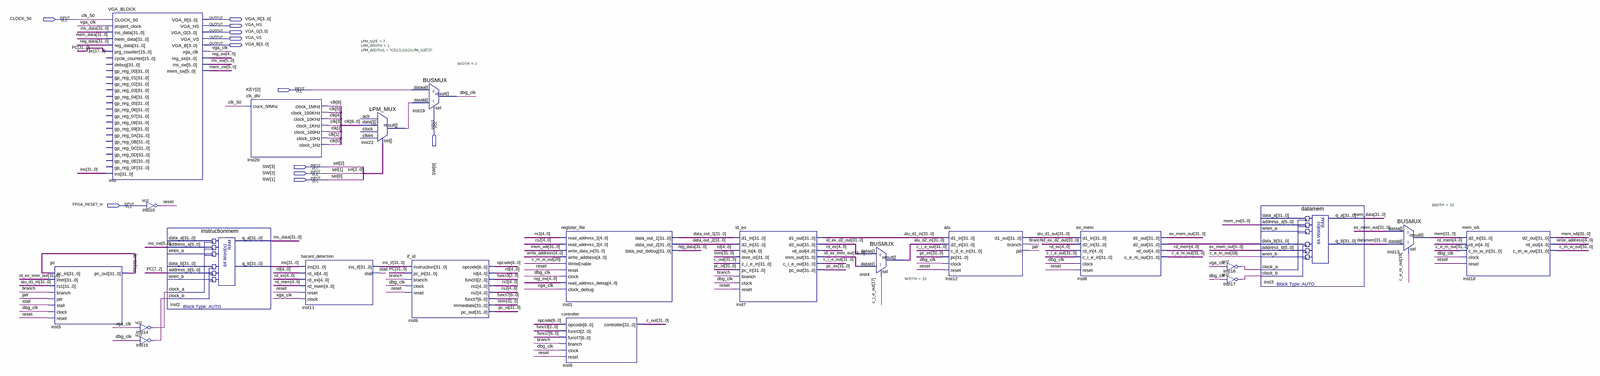
[diagram p0: schematic sheet, whole]
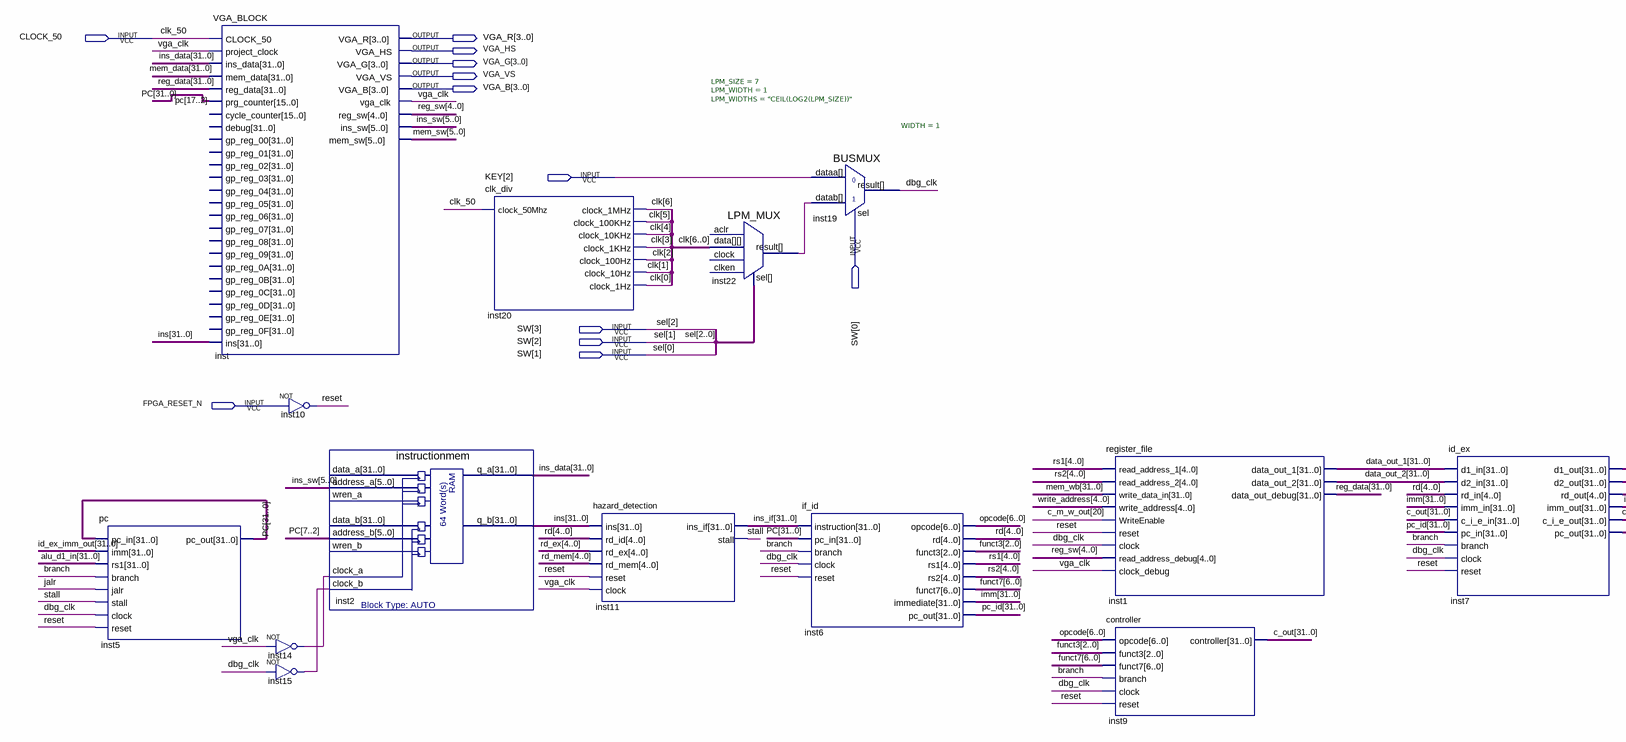
[diagram p1: schematic sheet, left part]
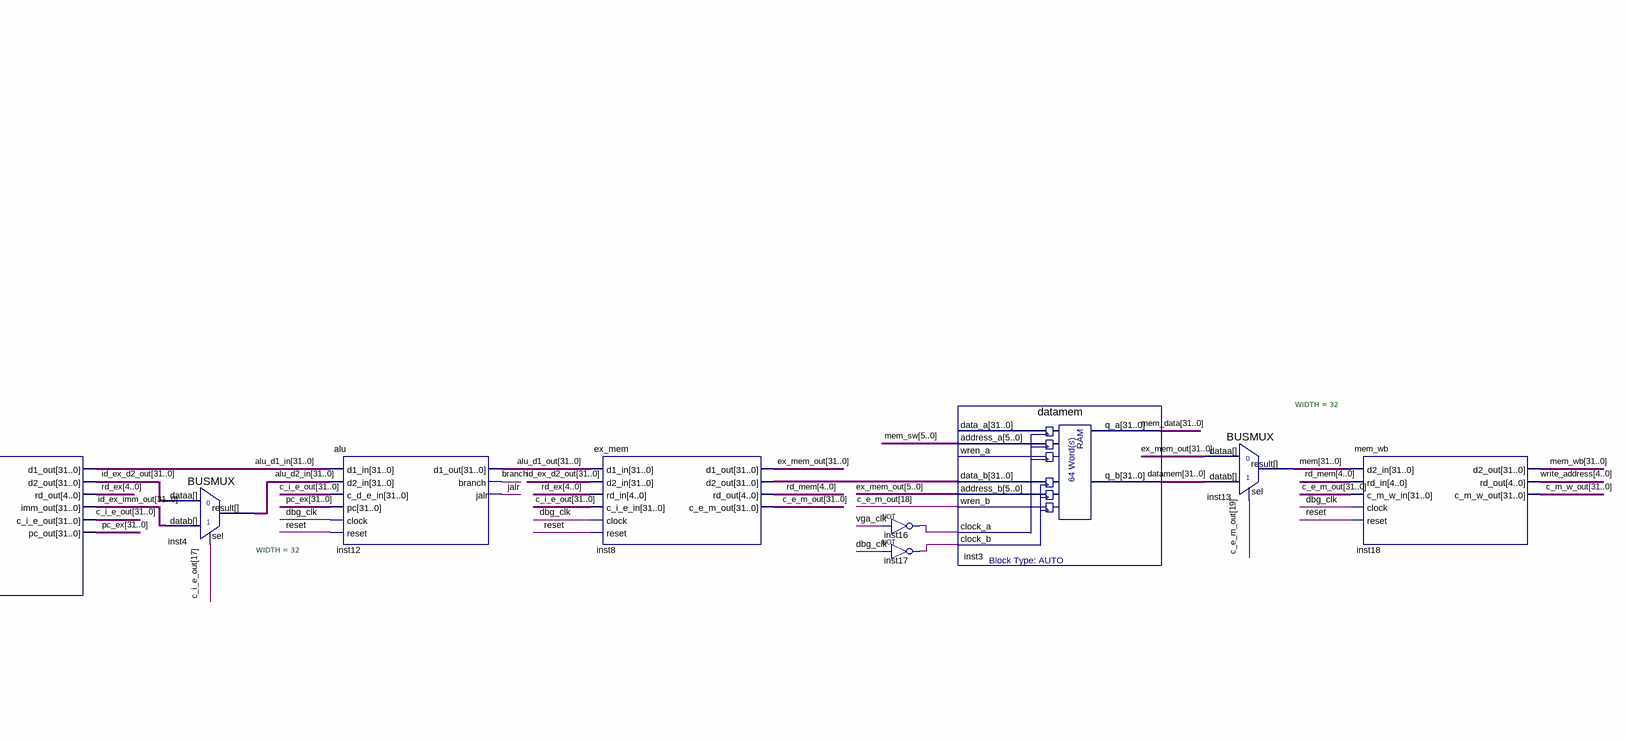
[diagram p2: schematic sheet, right part]
// Quartus schematic top.bdf as structural Verilog: 22 symbols, 12 pins
module top (
  input  CLOCK_50,
  input  [2:2] KEY,
  input  [3:0] SW,
  input  FPGA_RESET_N,
  output [3:0] VGA_R,
  output VGA_HS,
  output [3:0] VGA_G,
  output VGA_VS,
  output [3:0] VGA_B
);

  wire branch, dbg_clk, inst14_out, inst15_out, inst16_out, inst17_out, inst22_result, jalr, reset, stall,
       vga_clk;
  wire [2:0] funct3;
  wire [4:0] rd, rd_ex, rd_mem, reg_sw, rs1, rs2, write_address;
  wire [5:0] ins_sw, mem_sw;
  wire [6:0] clk, funct7, opcode;
  wire [31:0] alu_d1_in, alu_d1_out, alu_d2_in, c_e_m_out, c_i_e_out, c_m_w_out, c_out, data_out_1,
       data_out_2, datamem, ex_mem_out, id_ex_d2_out, id_ex_imm_out, imm, ins, ins_data, ins_if,
       inst8_d2_out, mem, mem_data, mem_wb, PC, pc_ex, pc_id, reg_data;

  pc inst5 (
    .pc_in(PC), .imm(id_ex_imm_out), .rs1(alu_d1_in), .branch(branch), .jalr(jalr), .stall(stall),
    .clock(dbg_clk), .reset(reset), .pc_out(PC));
  VGA_BLOCK inst (
    .CLOCK_50(CLOCK_50), .project_clock(vga_clk), .ins_data(ins_data), .mem_data(mem_data),
    .reg_data(reg_data), .prg_counter(PC[17:2]), .ins(ins), .VGA_R(VGA_R), .VGA_HS(VGA_HS), .VGA_G(VGA_G),
    .VGA_VS(VGA_VS), .VGA_B(VGA_B), .vga_clk(vga_clk), .reg_sw(reg_sw), .ins_sw(ins_sw), .mem_sw(mem_sw));  // open: cycle_counter, debug, gp_reg_00, gp_reg_01, gp_reg_02, gp_reg_03, gp_reg_04, gp_reg_05, gp_reg_06, gp_reg_07, gp_reg_08, gp_reg_09, gp_reg_0A, gp_reg_0B, gp_reg_0C, gp_reg_0D, gp_reg_0E, gp_reg_0F
  not inst10 (reset, FPGA_RESET_N);
  not inst14 (inst14_out, vga_clk);
  not inst15 (inst15_out, dbg_clk);
  instructionmem inst2 (
    .address_a(ins_sw), .address_b(PC[7:2]), .clock_a(inst14_out), .clock_b(inst15_out), .q_a(ins_data),
    .q_b(ins));  // open: data_a, wren_a, data_b, wren_b
  clk_div inst20 (
    .clock_50Mhz(CLOCK_50), .clock_1MHz(clk[6]), .clock_100KHz(clk[5]), .clock_10KHz(clk[4]),
    .clock_1KHz(clk[3]), .clock_100Hz(clk[2]), .clock_10Hz(clk[1]), .clock_1Hz(clk[0]));
  hazard_detection inst11 (
    .ins(ins), .rd_id(rd), .rd_ex(rd_ex), .rd_mem(rd_mem), .reset(reset), .clock(vga_clk), .ins_if(ins_if),
    .stall(stall));
  LPM_MUX #(.LPM_SIZE(7), .LPM_WIDTH(1), .LPM_WIDTHS("CEIL(LOG2(LPM_SIZE))")) inst22 (
    .data(clk), .sel(SW[3:1]), .result(inst22_result));  // open: clock, aclr, clken
  if_id inst6 (
    .instruction(ins_if), .pc_in(PC), .branch(branch), .clock(dbg_clk), .reset(reset), .opcode(opcode),
    .rd(rd), .funct3(funct3), .rs1(rs1), .rs2(rs2), .funct7(funct7), .immediate(imm), .pc_out(pc_id));
  BUSMUX #(.WIDTH(1)) inst19 (.datab(inst22_result), .sel(SW[0]), .dataa(KEY[2]), .result(dbg_clk));
  register_file inst1 (
    .read_address_1(rs1), .read_address_2(rs2), .write_data_in(mem_wb), .write_address(write_address),
    .WriteEnable(c_m_w_out[20]), .reset(reset), .clock(dbg_clk), .read_address_debug(reg_sw),
    .clock_debug(vga_clk), .data_out_1(data_out_1), .data_out_2(data_out_2), .data_out_debug(reg_data));
  controller inst9 (
    .opcode(opcode), .funct3(funct3), .funct7(funct7), .branch(branch), .clock(dbg_clk), .reset(reset),
    .controller(c_out));
  id_ex inst7 (
    .d1_in(data_out_1), .d2_in(data_out_2), .rd_in(rd), .imm_in(imm), .c_i_e_in(c_out), .pc_in(pc_id),
    .branch(branch), .clock(dbg_clk), .reset(reset), .d1_out(alu_d1_in), .d2_out(id_ex_d2_out),
    .rd_out(rd_ex), .imm_out(id_ex_imm_out), .c_i_e_out(c_i_e_out), .pc_out(pc_ex));
  BUSMUX #(.WIDTH(32)) inst4 (.datab(id_ex_imm_out), .sel(c_i_e_out[17]), .dataa(id_ex_d2_out), .result(alu_d2_in));
  alu inst12 (
    .d1_in(alu_d1_in), .d2_in(alu_d2_in), .c_d_e_in(c_i_e_out), .pc(pc_ex), .clock(dbg_clk), .reset(reset),
    .d1_out(alu_d1_out), .branch(branch), .jalr(jalr));
  ex_mem inst8 (
    .d1_in(alu_d1_out), .d2_in(id_ex_d2_out), .rd_in(rd_ex), .c_i_e_in(c_i_e_out), .clock(dbg_clk),
    .reset(reset), .d1_out(ex_mem_out), .d2_out(inst8_d2_out), .rd_out(rd_mem), .c_e_m_out(c_e_m_out));
  not inst16 (inst16_out, vga_clk);
  not inst17 (inst17_out, dbg_clk);
  datamem inst3 (
    .address_a(mem_sw), .data_b(inst8_d2_out), .address_b(ex_mem_out[5:0]), .wren_b(c_e_m_out[18]),
    .clock_a(inst16_out), .clock_b(inst17_out), .q_a(mem_data), .q_b(datamem));  // open: data_a, wren_a
  BUSMUX #(.WIDTH(32)) inst13 (.datab(datamem), .sel(c_e_m_out[19]), .dataa(ex_mem_out), .result(mem));
  mem_wb inst18 (
    .d2_in(mem), .rd_in(rd_mem), .c_m_w_in(c_e_m_out), .clock(dbg_clk), .reset(reset), .d2_out(mem_wb),
    .rd_out(write_address), .c_m_w_out(c_m_w_out));

  // Other names for the same wires on the sheet: clk_50 = CLOCK_50; sel[2:0] = SW[3:1]
endmodule
